# EAGLE design LEDproject.11.18.18 (EAGLE 9.2.0)
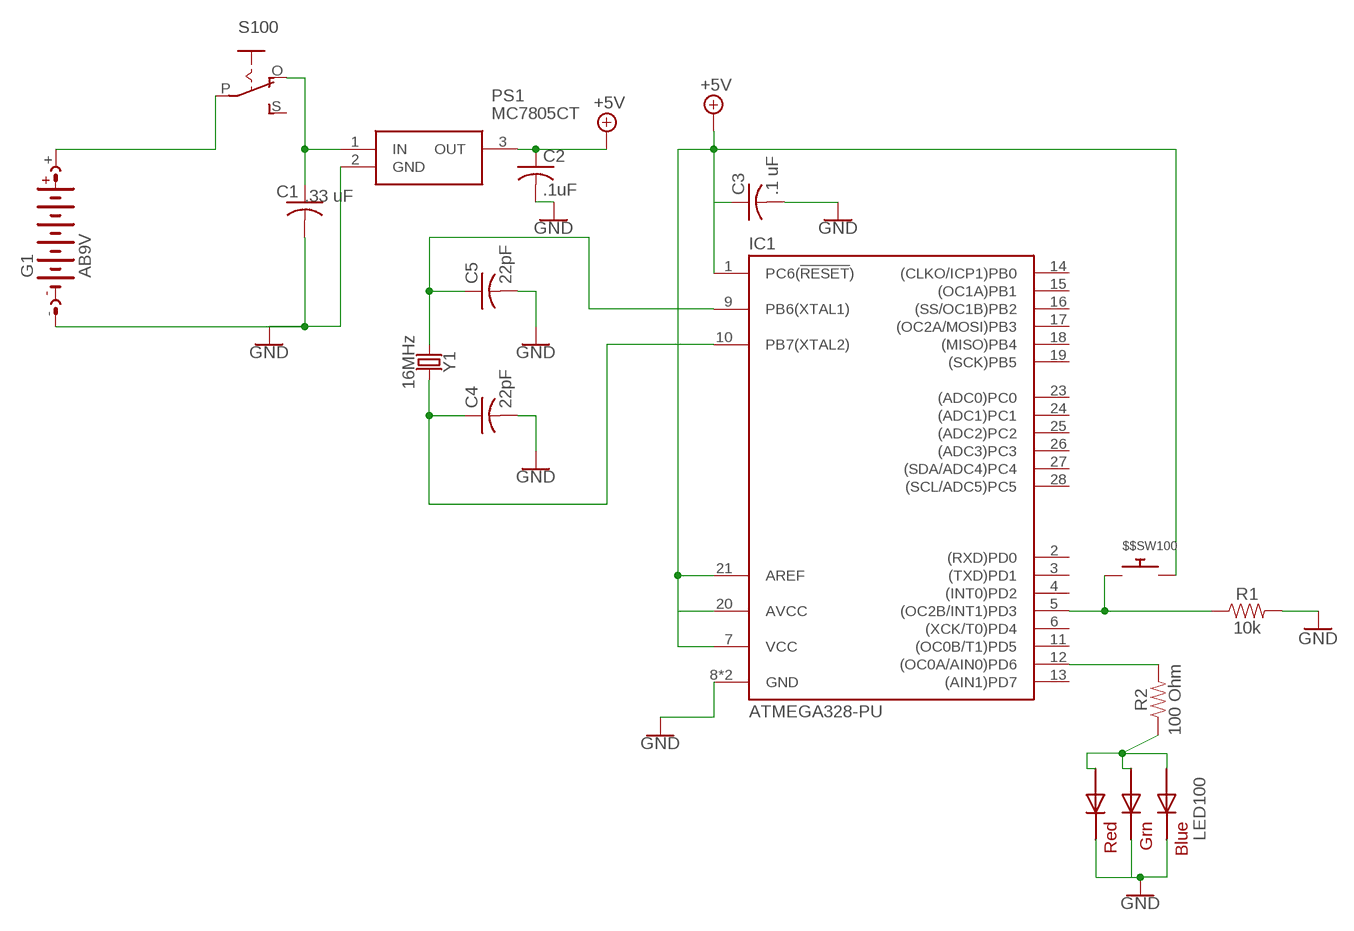
[diagram p0: schematic, sheet 1]

## Parts
$$SW100  SWITCH_PUSHBUTTONEVQ-PE  [TACT_PANA-EVQ]
C1  C-US025-030X050  [C025-030X050]
C2  .1uF  C-US025-030X050  [C025-030X050]
C3  .1 uF  C-US025-030X050  [C025-030X050]
C4  22pF  C-US025-030X050  [C025-030X050]
C5  22pF  C-US025-030X050  [C025-030X050]
G1  AB9V  [AB9V]
IC1  ATMEGA328-PU  [DIL28]
LED100  RGBLED5050  [RGBLED5050]
PS1  MC7805CT  [TO254P482X997X1968-3P]
R1  10k  10KOHM-HORIZ-1/6W-5%  [AXIAL-0.3]
R2  100 Ohm  10OHM-HORIZ-1/4W-1%  [AXIAL-0.3]
S100  EG1218S  [EG1218]
Y1  16MHz  CRYSTAL-16MHZPTH-HC49US  [HC49US]

## Nets
+5V: $$SW100.P$2 C2.1 C3.1 IC1.1(PC6(!RESET!)) IC1.7(VCC) IC1.20(AVCC) IC1.21(AREF) PS1.3(OUT)
GND: C1.2 C2.2 C3.2 C4.2 C5.2 G1.- IC1.8(GND) IC1.22(GND) LED100.4(BLUE_C) LED100.5(RED_C) LED100.6(GREEN_C) PS1.2(GND) R1.P$2
N$1: C5.1 IC1.9(PB6(XTAL1)) Y1.1
N$2: C4.1 IC1.10(PB7(XTAL2)) Y1.2
N$3: G1.+ S100.P
N$4: LED100.1(GREEN_A) LED100.2(RED_A) LED100.3(BLUE_A) R2.P$1
N$5: C1.1 PS1.1(IN) S100.O
N$6: $$SW100.P$1 IC1.5((OC2B/INT1)PD3) R1.P$1
N$7: IC1.12((OC0A/AIN0)PD6) R2.P$2
Unconnected: IC1.2((RXD)PD0) IC1.3((TXD)PD1) IC1.4((INT0)PD2) IC1.6((XCK/T0)PD4) IC1.11((OC0B/T1)PD5) IC1.13((AIN1)PD7) IC1.14((CLKO/ICP1)PB0) IC1.15((OC1A)PB1) IC1.16((SS/OC1B)PB2) IC1.17((OC2A/MOSI)PB3) IC1.18((MISO)PB4) IC1.19((SCK)PB5) IC1.23((ADC0)PC0) IC1.24((ADC1)PC1) IC1.25((ADC2)PC2) IC1.26((ADC3)PC3) IC1.27((SDA/ADC4)PC4) IC1.28((SCL/ADC5)PC5) S100.S

## Library data of the parts
$$SW100 = adafruit:SWITCH_PUSHBUTTON: Buttons SOFTTOUCHSMD_SJ - Soft touch temporary push button (Super Junk Akihabara) Compatible with SKPMANE010 [Mouser: 688-SKPMAN] C&K_KSS = Digikey: KSS221GLFS
C1 = adafruit:C-US: CAPACITOR, American symbol; BYPASS1: .33 uF
C2-C5 = adafruit:C-US: CAPACITOR, American symbol
G1 = battery:AB9V: 9-V BATTERY CLIP
IC1 = ATMEGA328-PU:ATMEGA328-PU: Atmel ATmega48/88/168/328 AVR Microcontroller; DESCRIPTION: ATmega Series 20 MHz 32 KB Flash 2 KB SRAM 8-Bit Microcontroller - DIP-28; DIGI-KEY_PART_NUMBER: ATMEGA328-PU-ND; DIGI-KEY_PURCHASE_URL: https://www.digikey.com/product-detail/en/microchip-technology/ATMEGA328-PU/ATMEGA328-PU-ND/2271026?utm_source=snapeda&utm_medium=aggregator&utm_campaign=symbol; MF: Microchip; MP: ATMEGA328-PU; PACKAGE: PDIP-28 Microchip
LED100 = adafruit:RGBLED: For 5050 RGB LEDs, the order of the LEDs may vary from one manufacturer to another!
PS1 = SamacSys_Parts:MC7805CT: ON linear voltage regulator,MC7805CT 5V Source: Datasheet <https://componentsearchengine.com/Datasheets/1/MC7805CT.pdf>; DESCRIPTION: ON linear voltage regulator,MC7805CT 5V; HEIGHT: 4.82mm; MANUFACTURER_NAME: ON Semiconductor; MANUFACTURER_PART_NUMBER: MC7805CT; MOUSER_PART_NUMBER: 863-MC7805CT
R1 = SparkFun-Resistors:10KOHM: 10kΩ resistor A resistor is a passive two-terminal electrical component that implements electrical resistance as a circuit element. Resistors act to reduce current flow, and, at the same time, act to lower voltage levels within circuits. - Wikipedia; PROD_ID: RES-08375
R2 = SparkFun-Resistors:10OHM: 10Ω resistor A resistor is a passive two-terminal electrical component that implements electrical resistance as a circuit element. Resistors act to reduce current flow, and, at the same time, act to lower voltage levels within circuits. - Wikipedia; PROD_ID: RES-12180; VALUE: 10
S100 = adafruit:EG1218: SLIDING SWITCH 0.1" spacing through hole, vertical SPDT slide switch http://www.ladyada.net/library/pcb/eaglelibrary.html
Y1 = SparkFun-Clocks:CRYSTAL-16MHZ: 16MHz Crystal Digikey Example <http://www.digikey.com/product-search/en?keywords=535-9122-1-ND> Frequency: 16MHz Frequency Stability: ±50ppm Frequency Tolerance: ±20ppm Load Capacitance: 18pF SparkFun Products: Pro Micro -5V/16MHz <https://www.sparkfun.com/products/12640> SparkFun Serial Enabled LCD Kit <https://www.sparkfun.com/products/10097>; PROD_ID: XTAL-08181; SF_ID: COM-00536

## Net classes
0 default: width 0.305 mm, drill 0.508 mm, clearance 0.305 mm

## Board
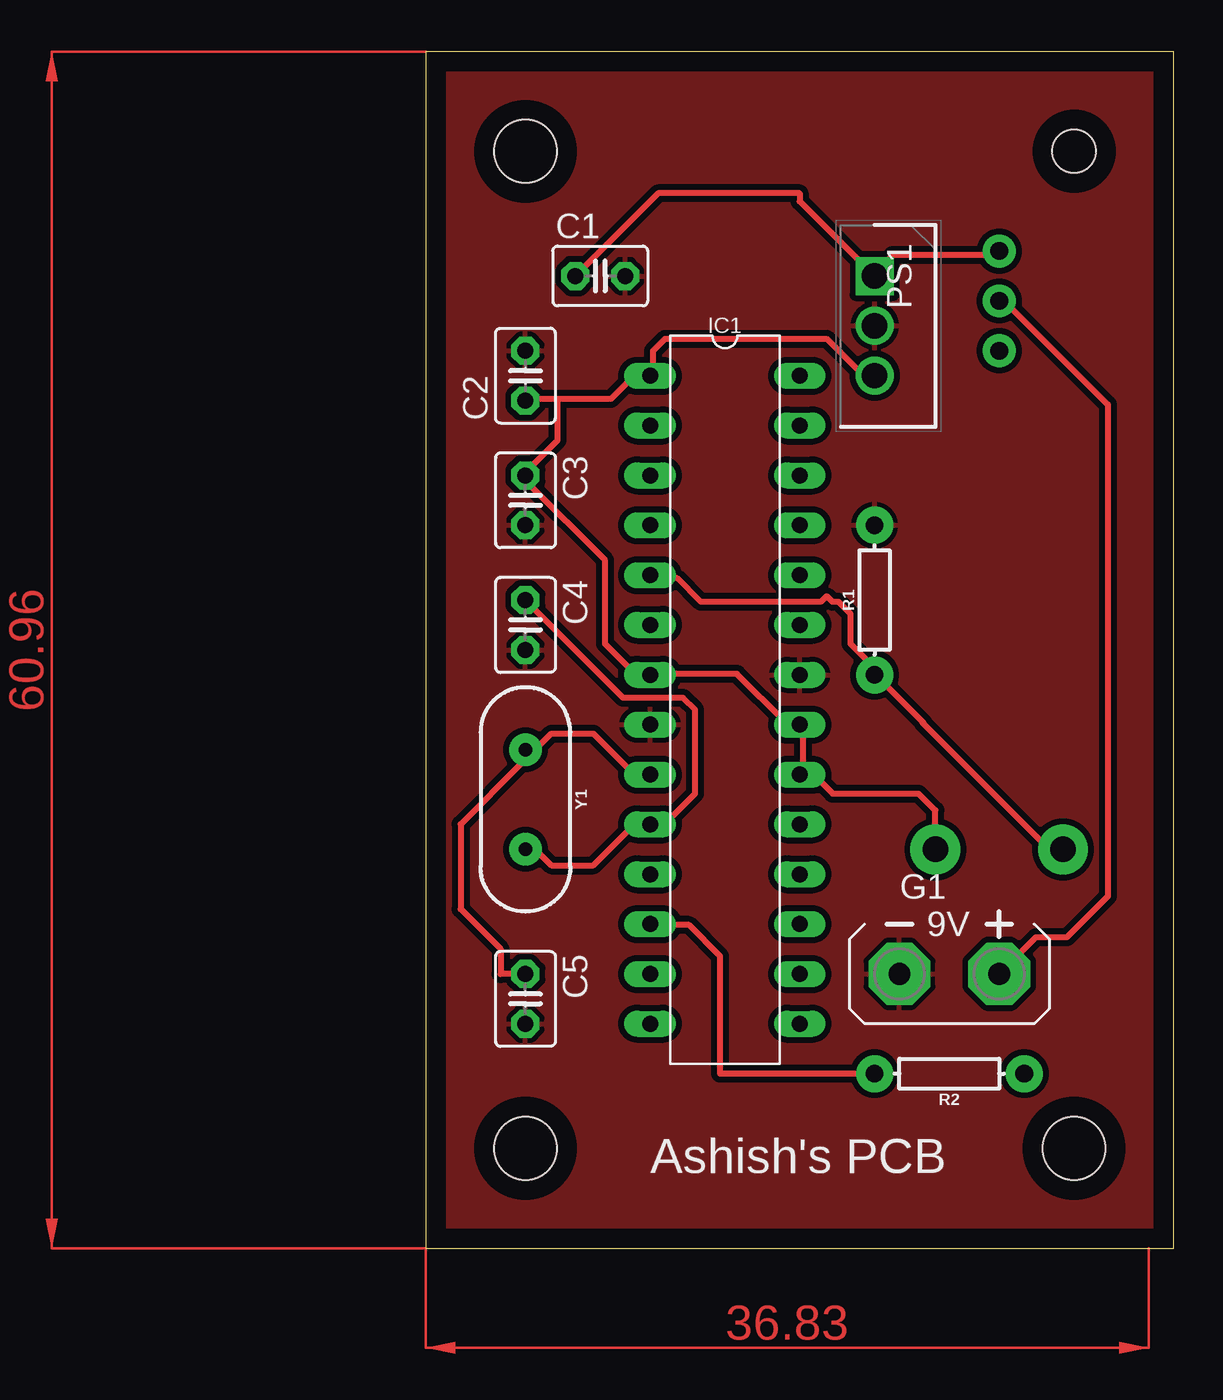
[diagram p1: board, top side]
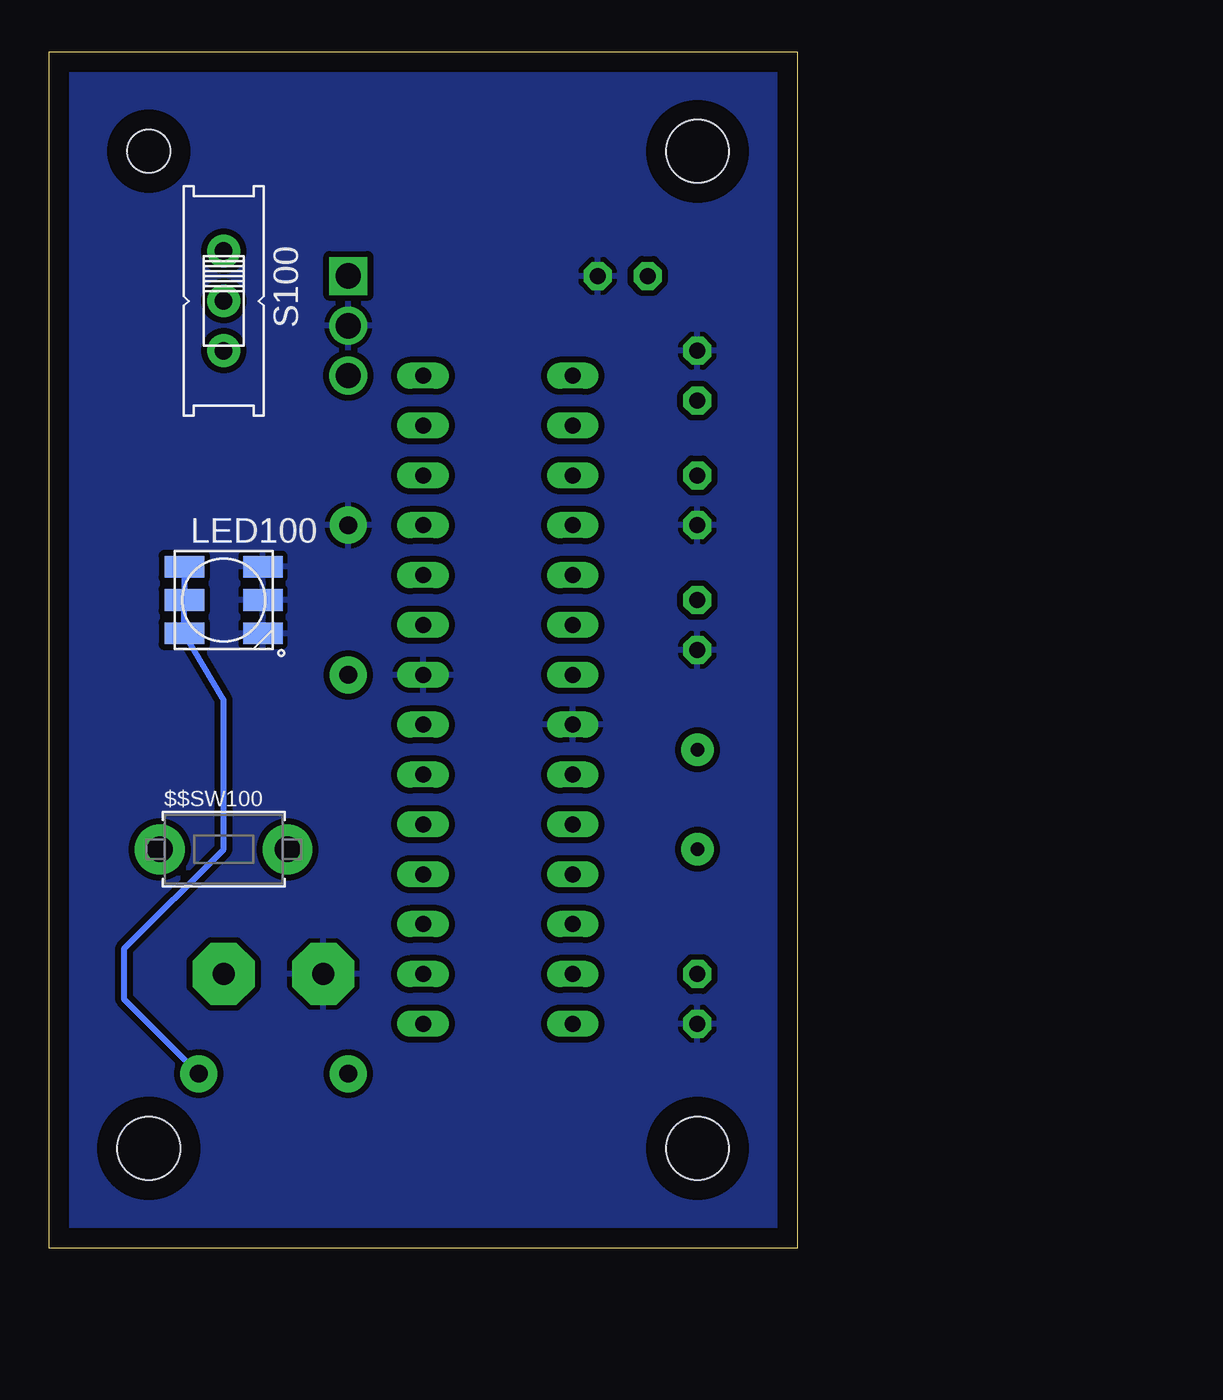
[diagram p2: board, bottom side, seen from below]

Size 38.1 x 60.96 mm. Coordinates in mm from the lower left corner, seen from the top.
Outline: 0,0 38.1,0 38.1,60.96 0,60.96 0,0
Copper layers (1*16): Top 0.035mm / dielectric 1.5mm / Bottom 0.035mm
Design rules "default": minimum track width 6mil, minimum drill 0.35mm, track to track 6mil, track to pad 6mil, pad to pad 6mil, via to via 6mil, smd to smd 6mil, copper to edge 40mil, drill to drill 6mil, minimum pad ring 10mil, minimum via ring 8mil, stop-mask expansion 4mil, vias tented up to drill 0mil, thermal gap 10mil
Holes 3.2 mm at 5.08,55.88 33.02,5.08 5.08,5.08
Holes 2.2 mm at 33.02,55.88

### Footprints (pad centres in the part's own frame; a part is rotated, then mirrored left to right if it is on the bottom)
TACT_PANA-EVQ = drill 1.3 pad 2.54: P$1 -3.25,0; P$2 3.25,0
C025-030X050 = drill 0.813 pad 1.422 octagon: 1 -1.27,0; 2 1.27,0
AB9V = drill 1.118 pad 3.15 octagon: + 0,2.54; - 0,-2.54
DIL28 = drill 0.813 long: 1 -3.81,16.51; 2 -3.81,13.97; 3 -3.81,11.43; 4 -3.81,8.89; 5 -3.81,6.35; 6 -3.81,3.81; 7 -3.81,1.27; 8 -3.81,-1.27; 9 -3.81,-3.81; 10 -3.81,-6.35; 11 -3.81,-8.89; 12 -3.81,-11.43; 13 -3.81,-13.97; 14 -3.81,-16.51; 15 3.81,-16.51; 16 3.81,-13.97; 17 3.81,-11.43; 18 3.81,-8.89; 19 3.81,-6.35; 20 3.81,-3.81; 21 3.81,-1.27; 22 3.81,1.27; 23 3.81,3.81; 24 3.81,6.35; 25 3.81,8.89; 26 3.81,11.43; 27 3.81,13.97; 28 3.81,16.51
RGBLED5050 = smd 2 x 1.1: 1 -2,1.7; 2 -2,0; 3 -2,-1.7; 4 2,-1.7; 5 2,0; 6 2,1.7
TO254P482X997X1968-3P = drill 1.29 pad 1.935 square: 1 0,0 | drill 1.29 pad 1.935: 2 2.54,0; 3 5.08,0
AXIAL-0.3 = drill 0.9 pad 1.88: P$1 -3.81,0; P$2 3.81,0
EG1218 = drill 0.9 pad 1.676: O -2.54,0; P 0,0; S 2.54,0
HC49US = drill 0.7 pad 1.651: 1 -2.54,0; 2 2.54,0

### Placement (x,y rotation side)
$$SW100  29.21,20.32 0 bottom
C1  8.89,49.53 0 top
C2  5.08,44.45 90 top
C3  5.08,38.1 270 top
C4  5.08,31.75 270 top
C5  5.08,12.7 270 top
G1  26.67,13.97 270 top
IC1  15.24,27.94 0 top
LED100  29.21,33.02 0 bottom
PS1  22.86,49.53 270 top
R1  22.86,33.02 90 top
R2  26.67,8.89 180 top
S100  29.21,48.26 270 bottom
Y1  5.08,22.86 270 top

### Tracks (layer width: path | path; a pad name or v marks a point on that pad's centre or on a via)
+5V
  Top 0.305: 6.71,43.28 5.18,43.28 C2.1 | 6.71,43.28 9.45,43.28 10.36,44.2 11.28,44.2 IC1.1 11.58,44.5 11.58,45.72 12.19,46.33 20.42,46.33 22.25,44.5 22.86,44.5 PS1.3 | 6.71,43.28 6.71,41.15 5.18,39.62 C3.1 5.18,39.32 5.18,39.01 9.14,35.05 9.14,30.79 10.67,29.26 11.28,29.26 IC1.7 11.58,29.26 15.85,29.26 18.29,26.82 18.9,26.82 IC1.21 19.2,26.52 19.2,24.69 | 19.2,24.69 19.2,24.38 IC1.20 19.2,24.69 | $$SW100.P$2 25.96,22.3 25.09,23.16 20.73,23.16 19.2,24.69
GND
  pour Top: 0,101.6 77.47,101.6 77.47,0 0,0
  pour Bottom: -3.81,-1.27 -3.81,67.31 36.83,67.31 41.91,62.23 41.91,-2.54 40.64,-1.27
N$1
  Top 0.305: IC1.9 11.28,24.38 10.36,24.38 8.53,26.21 6.4,26.21 5.79,25.6 5.18,25.6 Y1.1 4.88,25.3 4.88,24.69 1.78,21.59 1.78,17.27 3.81,15.24 3.81,13.97 C5.1
N$2
  Top 0.305: Y1.2 5.18,20.12 5.79,20.12 6.4,19.51 8.53,19.51 10.36,21.34 11.28,21.34 IC1.10 11.58,21.64 12.19,21.64 13.72,23.16 13.72,27.43 13.11,28.04 10.06,28.04 C4.1
N$3
  Top 0.305: G1.+ 31.09,15.85 32.66,15.85 34.75,17.93 34.75,42.98 29.57,48.16 29.26,48.16 S100.P
N$4
  Bottom 0.305: R2.P$1 34.29,12.7 34.29,15.24 29.21,20.32 29.21,27.94 LED100.3 LED100.2 LED100.1
N$5
  Top 0.305: C1.1 11.84,53.75 19.05,53.75 19.05,53.34 PS1.1 22.86,49.68 23.77,50.6 28.96,50.6 S100.O
N$6
  Top 0.305: 22.86,29.26 22.86,29.57 21.64,30.79 21.64,32.31 21.03,32.92 20.73,32.92 20.42,33.22 20.12,32.92 14.02,32.92 12.8,34.14 11.58,34.14 IC1.5 | $$SW100.P$1 31.75,20.32 25.3,26.77 25.35,26.77 22.86,29.26 | 22.86,29.26 R1.P$1
N$7
  Top 0.305: IC1.12 11.58,16.46 13.41,16.46 14.99,14.88 14.99,8.89 R2.P$2
(copper drawn outside any net)
  shapes: Top area x2

### Text on the board
_tsilk: Ashish's PCB